# Altium schematic sheet DVD.SchDoc (part 1 of 3)
size A1; SheetNumber: 1; SheetTotal: 1
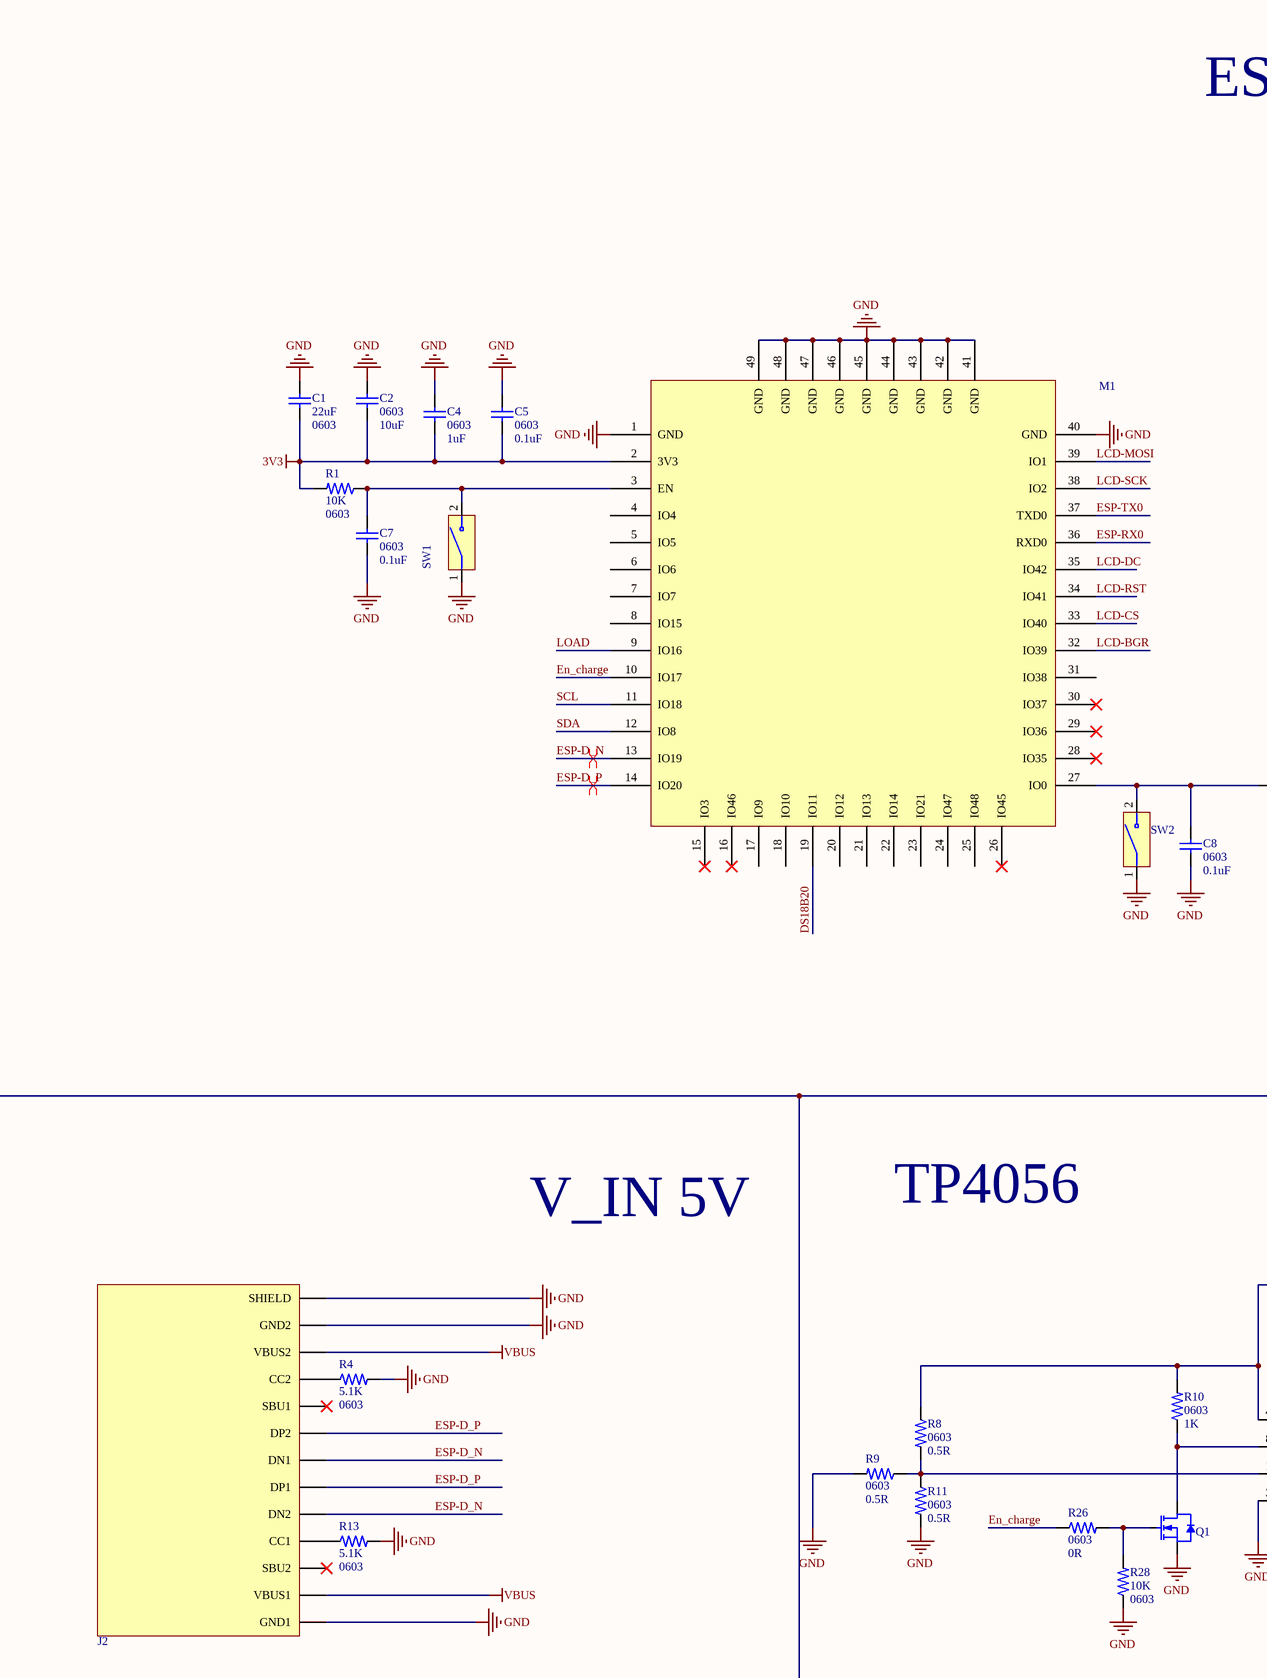
[diagram p0: DVD.SchDoc, top left]
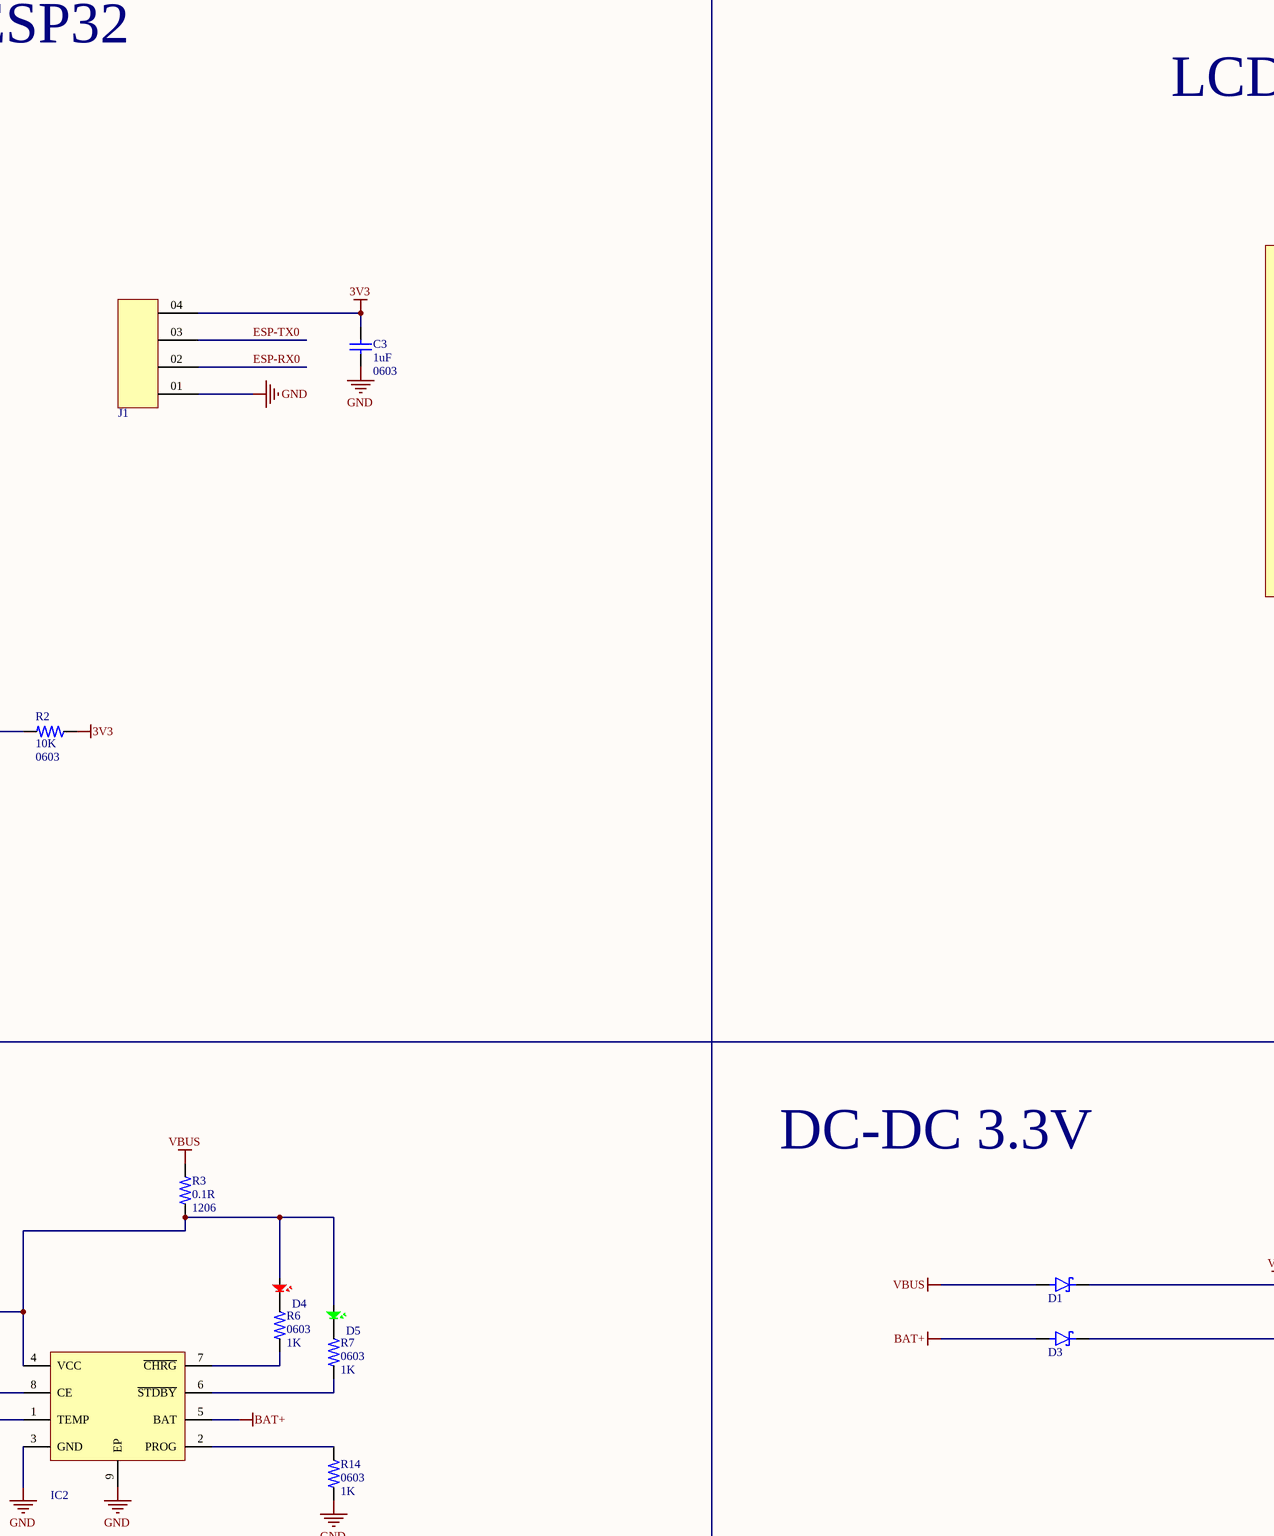
[diagram p1: DVD.SchDoc, top middle]
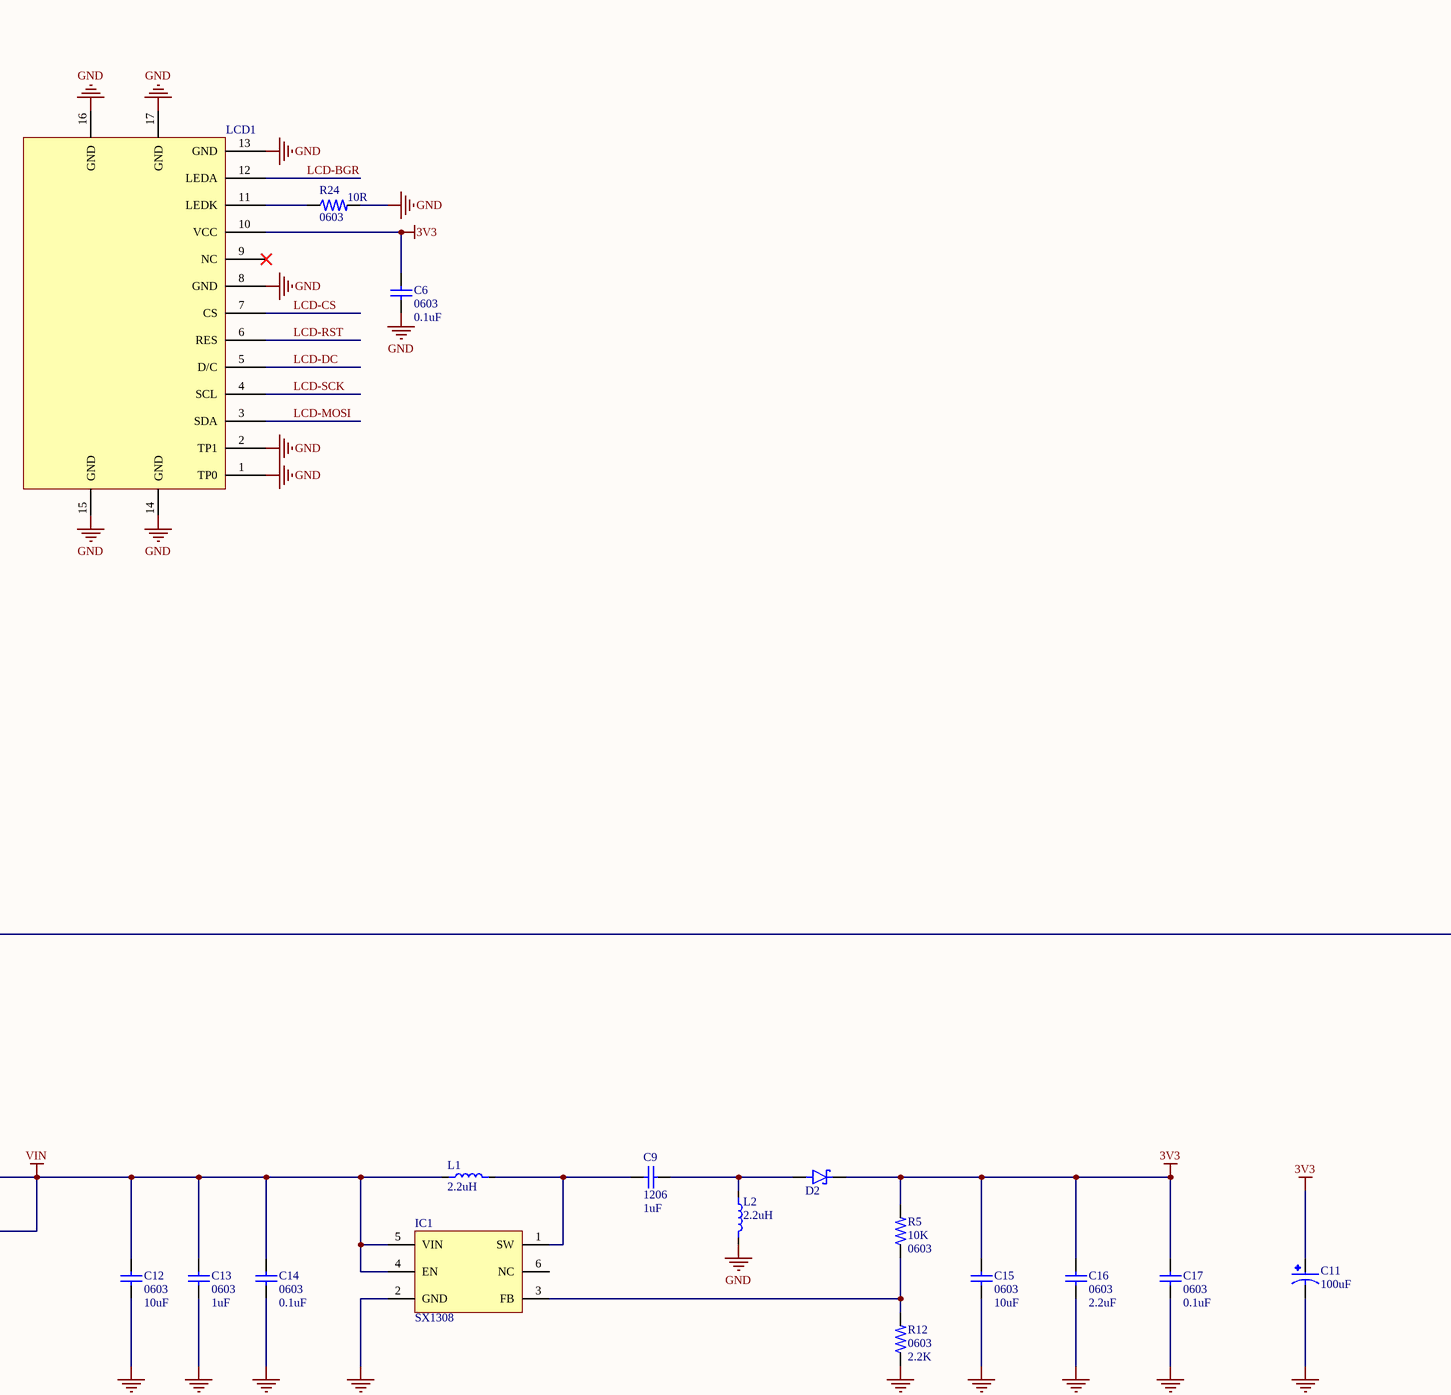
[diagram p2: DVD.SchDoc, top right]
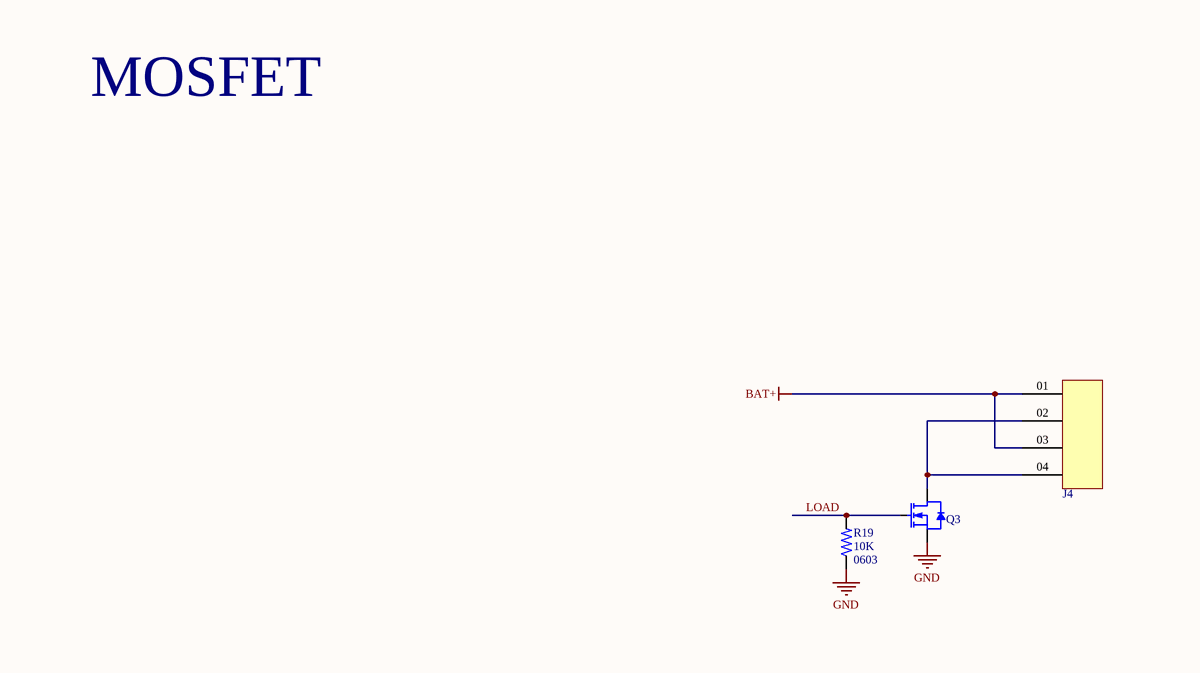
[diagram p3: DVD.SchDoc, bottom left]
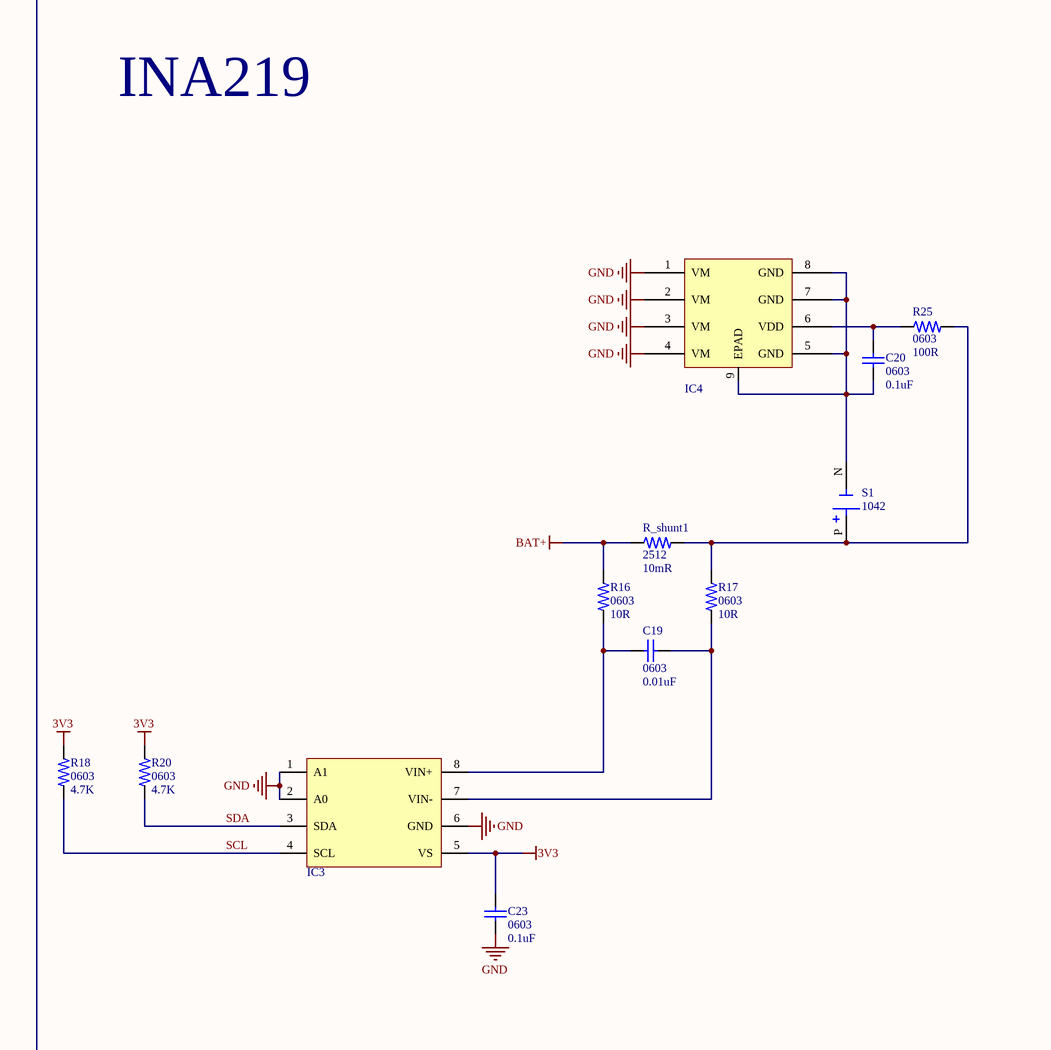
[diagram p4: DVD.SchDoc, bottom middle]
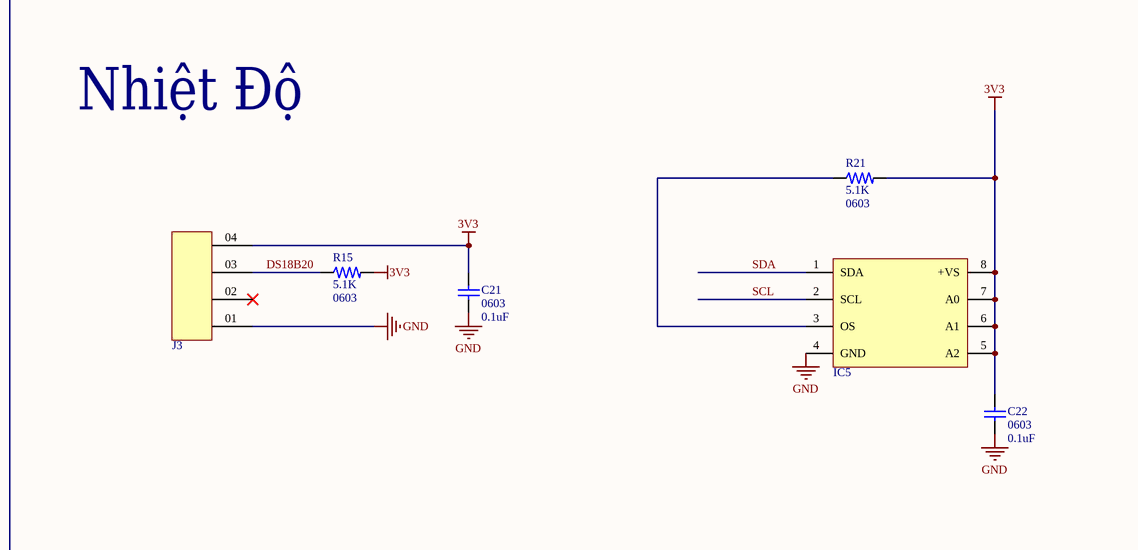
[diagram p5: DVD.SchDoc, bottom right]

## Parts
C1  value 22uF  Package: 0603  [SMD-CAP-0603-YAGEO]  (hidden comment: 22 µF ±20% 10V Ceramic Capacitor X5R 0603 (1608 Metric))
C2  value 10uF  Package: 0603  [SMD-CAP-0603-YAGEO]  (hidden comment: 10 µF ±20% 25V Ceramic Capacitor X5R 0603 (1608 Metric))
C3  value 1uF  Package: 0603  [SMD-CAP-0603-YAGEO]  (hidden comment: 1 µF ±10% 16V Ceramic Capacitor X7R 0603 (1608 Metric))
C4  value 1uF  Package: 0603  [SMD-CAP-0603-YAGEO]  (hidden comment: 1 µF -20%, +80% 10V Ceramic Capacitor Y5V (F) 0603 (1608 Metric))
C5  value 0.1uF  Package: 0603  [SMD-CAP-0603-YAGEO]  (hidden comment: 0.1 µF ±10% 16V Ceramic Capacitor X7R 0603 (1608 Metric))
C6  value 0.1uF  Package: 0603  [SMD-CAP-0603-YAGEO]  (hidden comment: 0.1 µF ±10% 16V Ceramic Capacitor X7R 0603 (1608 Metric))
C7  value 0.1uF  Package: 0603  [SMD-CAP-0603-YAGEO]  (hidden comment: 0.1 µF ±10% 100V Ceramic Capacitor X7R 0603 (1608 Metric))
C8  value 0.1uF  Package: 0603  [SMD-CAP-0603-YAGEO]  (hidden comment: 0.1 µF ±10% 100V Ceramic Capacitor X7R 0603 (1608 Metric))
C9  value 1uF  Package: 1206  [SMD-CAP-1206-KEMET]  (hidden comment: 1 µF ±10% 100V Ceramic Capacitor X7R 1206 (3216 Metric))
C11  value 100uF  [SMD-DxLxW-6.3x6.6x6.6-PEC]  (hidden comment: 100 µF 25 V Aluminum - Polymer Capacitors Radial, Can - SMD 30mOhm 10000 Hrs @ 105°C)
C12  value 10uF  Package: 0603  [SMD-CAP-0603-YAGEO]  (hidden comment: 10 µF ±20% 25V Ceramic Capacitor X5R 0603 (1608 Metric))
C13  value 1uF  Package: 0603  [SMD-CAP-0603-YAGEO]  (hidden comment: 1 µF -20%, +80% 10V Ceramic Capacitor Y5V (F) 0603 (1608 Metric))
C14  value 0.1uF  Package: 0603  [SMD-CAP-0603-YAGEO]  (hidden comment: 0.1 µF ±10% 16V Ceramic Capacitor X7R 0603 (1608 Metric))
C15  value 10uF  Package: 0603  [SMD-CAP-0603-YAGEO]  (hidden comment: 10 µF ±20% 25V Ceramic Capacitor X5R 0603 (1608 Metric))
C16  value 2.2uF  Package: 0603  [SMD-CAP-0603-YAGEO]  (hidden comment: 2.2 µF ±10% 25V Ceramic Capacitor X5R 0603 (1608 Metric))
C17  value 0.1uF  Package: 0603  [SMD-CAP-0603-YAGEO]  (hidden comment: 0.1 µF ±10% 100V Ceramic Capacitor X7R 0603 (1608 Metric))
C19  value 0.01uF  Package: 0603  [SMD-CAP-0603-YAGEO]  (hidden comment: 0.1 µF ±10% 10V Ceramic Capacitor X7R 0603 (1608 Metric))
C20  value 0.1uF  Package: 0603  [SMD-CAP-0603-YAGEO]  (hidden comment: 0.1 µF ±10% 16V Ceramic Capacitor X7R 0603 (1608 Metric))
C21  value 0.1uF  Package: 0603  [SMD-CAP-0603-YAGEO]  (hidden comment: 0.1 µF ±10% 16V Ceramic Capacitor X7R 0603 (1608 Metric))
C22  value 0.1uF  Package: 0603  [SMD-CAP-0603-YAGEO]  (hidden comment: 0.1 µF ±10% 16V Ceramic Capacitor X7R 0603 (1608 Metric))
C23  value 0.1uF  Package: 0603  [SMD-CAP-0603-YAGEO]  (hidden comment: 0.1 µF ±10% 16V Ceramic Capacitor X7R 0603 (1608 Metric))
D1  Diode 40 V 3A Surface Mount DO-214AC (SMA)  [SMD-DO-214AC-214-CT]  (value not drawn)
D2  Diode 40 V 3A Surface Mount DO-214AC (SMA)  [SMD-DO-214AC-214-CT]  (value not drawn)
D3  Diode 40 V 3A Surface Mount DO-214AC (SMA)  [SMD-DO-214AC-214-CT]  (value not drawn)
D4  0603 RED  [LED0603_RED]  (value not drawn)
D5  0603 GREEN  [LED0603_GREEN]  (value not drawn)
IC1  SX1308  [SOT23-6-SX1308]
IC2  TP4056  [SOIC-8-TP4056]  (value not drawn)
IC3  Current Monitor Regulator High-Side 10mA 8-SOIC  [SOIC-8-TI]  (value not drawn)
IC4  XB8089D  [SOIC-8-XB8089D]  (value not drawn)
IC5  Temperature Sensor Digital, Local -55°C ~ 125°C 9 b 8-SOIC  [SOIC-8-ADI]  (value not drawn)
J1  Connector Header Through Hole 4 position 0.100" (2.54mm)  [HEADER-2.54-4 - U3D]  (value not drawn)
J2  USB-C (USB TYPE-C) USB 2.0 Receptacle Connector 24 (16+8 Dummy) Position Surface Mount, Right Angle; Through Hole  [TYPE-C-HOR-RECEPTACLE-24PIN-MOLEX]  (value not drawn)
J3  Connector Header Through Hole 4 position 0.100" (2.54mm)  [HEADER-2.54-4 - U3D]  (value not drawn)
J4  Connector Header Through Hole 4 position 0.100" (2.54mm)  [HEADER-2.54-4 - U3D]  (value not drawn)
L1  value 2.2uH  [SMD-HxLxW-3.0x5.5x5.0-PEC]  (hidden comment: 2.2 µH Shielded Drum Core, Wirewound Inductor 6.3 A 22mOhm Max 2-SMD, J-Lead)
L2  value 2.2uH  [SMD-HxLxW-3.0x5.5x5.0-PEC]  (hidden comment: 2.2 µH Shielded Drum Core, Wirewound Inductor 6.3 A 22mOhm Max 2-SMD, J-Lead)
LCD1  LCD ST7789  [ST7735S-80x160-0.96INCH]  (value not drawn)
M1  Bluetooth, WiFi 802.11b/g/n, Bluetooth v4.2 +EDR Transceiver Module 2.4GHz ~ 2.5GHz PCB Trace Surface Mount  [MODULE-ESP32-S3-WROOM-1-N16R8]  (value not drawn)
Q1  N-Channel 30 V 5.7A (Ta) 1.4W (Ta) Surface Mount SOT-23-3  [SOT23-3-AOEI]  (value not drawn)
Q3  N-Channel 60 V 7A (Ta), 37A (Tc) 2.1W (Ta), 60W (Tc) Surface Mount TO-252 (DPAK)  [TO252]  (value not drawn)
R1  value 10K  Package: 0603  [SMD-RES-0603-YAGEO]  (hidden comment: 10 kOhms ±1% 0.1W, 1/10W Chip Resistor 0603 (1608 Metric) Moisture Resistant Thick Film)
R2  value 10K  Package: 0603  [SMD-RES-0603-YAGEO]  (hidden comment: 10 kOhms ±1% 0.1W, 1/10W Chip Resistor 0603 (1608 Metric) Moisture Resistant Thick Film)
R3  value 0.1R  Package: 1206  [SMD-RES-1206-YAGEO]  (hidden comment: 100 mOhms ±5% 0.25W, 1/4W Chip Resistor 1206 (3216 Metric) Current Sense Thick Film)
R4  value 5.1K  Package: 0603  [SMD-RES-0603-SEI]  (hidden comment: 5.1 kOhms ±1% 0.1W, 1/10W Chip Resistor 0603 (1608 Metric) Automotive AEC-Q200 Thick Film)
R5  value 10K  Package: 0603  [SMD-RES-0603-YAGEO]  (hidden comment: 10 kOhms ±1% 0.1W, 1/10W Chip Resistor 0603 (1608 Metric) Moisture Resistant Thick Film)
R6  value 1K  Package: 0603  [SMD-RES-0603-SEI]  (hidden comment: 1 kOhms ±1% 0.25W, 1/4W Chip Resistor 0603 (1608 Metric) Automotive AEC-Q200, Pulse Withstanding Thick Film)
R7  value 1K  Package: 0603  [SMD-RES-0603-SEI]  (hidden comment: 1 kOhms ±1% 0.25W, 1/4W Chip Resistor 0603 (1608 Metric) Automotive AEC-Q200, Pulse Withstanding Thick Film)
R8  value 0.5R  Package: 0603  [SMD-RES-0603-RS]  (hidden comment: 510 mOhms ±1% 0.2W, 1/5W Chip Resistor 0603 (1608 Metric) Automotive AEC-Q200, Current Sense Thick Film)
R9  value 0.5R  Package: 0603  [SMD-RES-0603-RS]  (hidden comment: 510 mOhms ±1% 0.2W, 1/5W Chip Resistor 0603 (1608 Metric) Automotive AEC-Q200, Current Sense Thick Film)
R10  value 1K  Package: 0603  [SMD-RES-0603-SEI]  (hidden comment: 1 kOhms ±1% 0.25W, 1/4W Chip Resistor 0603 (1608 Metric) Automotive AEC-Q200, Pulse Withstanding Thick Film)
R11  value 0.5R  Package: 0603  [SMD-RES-0603-RS]  (hidden comment: 510 mOhms ±1% 0.2W, 1/5W Chip Resistor 0603 (1608 Metric) Automotive AEC-Q200, Current Sense Thick Film)
R12  value 2.2K  Package: 0603  [SMD-RES-0603-SEI]  (hidden comment: 2.2 kOhms ±1% 0.1W, 1/10W Chip Resistor 0603 (1608 Metric) Automotive AEC-Q200 Thick Film)
R13  value 5.1K  Package: 0603  [SMD-RES-0603-SEI]  (hidden comment: 5.1 kOhms ±1% 0.1W, 1/10W Chip Resistor 0603 (1608 Metric) Automotive AEC-Q200 Thick Film)
R14  value 1K  Package: 0603  [SMD-RES-0603-SEI]  (hidden comment: 1 kOhms ±1% 0.25W, 1/4W Chip Resistor 0603 (1608 Metric) Automotive AEC-Q200, Pulse Withstanding Thick Film)
R15  value 5.1K  Package: 0603  [SMD-RES-0603-SEI]  (hidden comment: 5.1 kOhms ±1% 0.1W, 1/10W Chip Resistor 0603 (1608 Metric) Automotive AEC-Q200 Thick Film)
R16  value 10R  Package: 0603  [SMD-RES-0603-SE]  (hidden comment: 10 Ohms ±1% 0.1W, 1/10W Chip Resistor 0603 (1608 Metric) Automotive AEC-Q200 Thick Film)
R17  value 10R  Package: 0603  [SMD-RES-0603-SE]  (hidden comment: 10 Ohms ±1% 0.1W, 1/10W Chip Resistor 0603 (1608 Metric) Automotive AEC-Q200 Thick Film)
R18  value 4.7K  Package: 0603  [SMD-RES-0603-RS]  (hidden comment: 4.7 kOhms ±1% 0.1W, 1/10W Chip Resistor 0603 (1608 Metric) Anti-Sulfur Thick Film)
R19  value 10K  Package: 0603  [SMD-RES-0603-YAGEO]  (hidden comment: 10 kOhms ±1% 0.1W, 1/10W Chip Resistor 0603 (1608 Metric) Moisture Resistant Thick Film)
R20  value 4.7K  Package: 0603  [SMD-RES-0603-RS]  (hidden comment: 4.7 kOhms ±1% 0.1W, 1/10W Chip Resistor 0603 (1608 Metric) Anti-Sulfur Thick Film)
R21  value 5.1K  Package: 0603  [SMD-RES-0603-SEI]  (hidden comment: 5.1 kOhms ±1% 0.1W, 1/10W Chip Resistor 0603 (1608 Metric) Automotive AEC-Q200 Thick Film)
R24  value 10R  Package: 0603  [SMD-RES-0603-SE]  (hidden comment: 10 Ohms ±1% 0.1W, 1/10W Chip Resistor 0603 (1608 Metric) Automotive AEC-Q200 Thick Film)
R25  value 100R  Package: 0603  [SMD-RES-0603-RS]  (hidden comment: 100 Ohms ±1% 0.1W, 1/10W Chip Resistor 0603 (1608 Metric) Automotive AEC-Q200, High Voltage Thick Film)
R26  value 0R  Package: 0603  [SMD-RES-0603-SEI]  (hidden comment: 0 Ohms Jumper Chip Resistor 0603 (1608 Metric) Automotive AEC-Q200 Thick Film)
R28  value 10K  Package: 0603  [SMD-RES-0603-YAGEO]  (hidden comment: 10 kOhms ±1% 0.1W, 1/10W Chip Resistor 0603 (1608 Metric) Moisture Resistant Thick Film)
R_shunt1  value 10mR  Package: 2512  [SMD-RES-2512-VD]  (hidden comment: 0.1R)
S1  1042  [SMD-18650-BAT-1042]
SW1  Tactile Switch SPST-NO Top Actuated Surface Mount  [SW-HxLxW-5.0x6.0x3.5-C&K]  (value not drawn)
SW2  Tactile Switch SPST-NO Top Actuated Surface Mount  [SW-HxLxW-5.0x6.0x3.5-C&K]  (value not drawn)

## Nets
3V3: C1.2 C2.1 C3.1 C4.2 C5.2 C6.2 C11.1 C15.1 C16.2 C17.2 C21.2 C22.2 C23.2 D2.1(K) IC3.5(VS) IC5.5(A2) IC5.6(A1) IC5.7(A0) IC5.8(+VS) J1.04 J3.04 LCD1.10(VCC) M1.2(3V3) R1.2 R2.1 R5.2 R15.2 R18.1 R20.1 R21.2
BAT+: D3.2(A) IC2.5(BAT) J4.01 J4.03 R16.1 R_shunt1.1
GND: C1.1 C2.2 C3.2 C4.1 C5.1 C6.1 C7.1 C8.1 C11.2 C12.1 C13.1 C14.1 C15.2 C16.1 C17.1 C21.1 C22.1 C23.1 IC1.2(GND) IC2.3(GND) IC2.9(EP) IC3.1(A1) IC3.2(A0) IC3.6(GND) IC4.1(VM) IC4.2(VM) IC4.3(VM) IC4.4(VM) IC5.4(GND) J1.01 J2.A1B12(GND1) J2.B1A12(GND2) J2.SHIELD J3.01 L2.2 LCD1.1(TP0) LCD1.2(TP1) LCD1.8(GND) LCD1.13(GND) LCD1.14(GND) LCD1.15(GND) LCD1.16(GND) LCD1.17(GND) M1.1(GND) M1.40(GND) M1.41(GND) M1.42(GND) M1.43(GND) M1.44(GND) M1.45(GND) M1.46(GND) M1.47(GND) M1.48(GND) M1.49(GND) Q1.2(S) Q3.2(S) R4.2 R9.2 R11.2 R12.1 R13.2 R14.2 R19.1 R24.2 R28.1 SW1.1(COM) SW2.1(COM)
VBUS: D1.2(A) J2.A4B9(VBUS1) J2.B4A9(VBUS2) R3.1
VIN: C12.2 C13.2 C14.2 D1.1(K) D3.1(K) IC1.4(EN) IC1.5(VIN) L1.1
DS18B20: J3.03 M1.19(IO11) R15.1
En_charge: M1.10(IO17) R26.1
ESP-D_N: J2.A7(DN1) J2.B7(DN2) M1.13(IO19)
ESP-D_P: J2.A6(DP1) J2.B6(DP2) M1.14(IO20)
ESP-RX0: J1.02 M1.36(RXD0)
ESP-TX0: J1.03 M1.37(TXD0)
LCD-BGR: LCD1.12(LEDA) M1.32(IO39)
LCD-CS: LCD1.7(CS) M1.33(IO40)
LCD-DC: LCD1.5(D/C) M1.35(IO42)
LCD-MOSI: LCD1.3(SDA) M1.39(IO1)
LCD-RST: LCD1.6(RES) M1.34(IO41)
LCD-SCK: LCD1.4(SCL) M1.38(IO2)
LOAD: M1.9(IO16) Q3.1(G) R19.2
SCL: IC3.4(SCL) IC5.2(SCL) M1.11(IO18) R18.2
SDA: IC3.3(SDA) IC5.1(SDA) M1.12(IO8) R20.2
NetC7_2: C7.2 M1.3(EN) R1.1 SW1.2(NO)
NetC8_2: C8.2 M1.27(IO0) R2.2 SW2.2(NO)
NetC9_1: C9.1 IC1.1(SW) L1.2
NetC9_2: C9.2 D2.2(A) L2.1
NetC19_1: C19.1 IC3.8(VIN+) R16.2
NetC19_2: C19.2 IC3.7(VIN-) R17.2
NetC20_1: C20.1 IC4.5(GND) IC4.7(GND) IC4.8(GND) IC4.9(EPAD) S1.N(NEG)
NetC20_2: C20.2 IC4.6(VDD) R25.1
NetD4_1: D4.1 D5.1 IC2.4(VCC) R3.2 R8.1 R10.2
NetD4_2: D4.2 R6.1
NetD5_2: D5.2 R7.1
NetIC1_3: IC1.3(FB) R5.1 R12.2
NetIC2_1: IC2.1(TEMP) R8.2 R9.1 R11.1
NetIC2_2: IC2.2(PROG) R14.1
NetIC2_6: IC2.6(~{STDBY}) R7.2
NetIC2_7: IC2.7(~{CHRG}) R6.2
NetIC2_8: IC2.8(CE) Q1.3(D) R10.1
NetIC5_3: IC5.3(OS) R21.1
NetJ2_A5: J2.A5(CC1) R13.1
NetJ2_B5: J2.B5(CC2) R4.1
NetJ4_02: J4.02 J4.04 Q3.3(D)
NetLCD1_11: LCD1.11(LEDK) R24.1
NetQ1_1: Q1.1(G) R26.2 R28.2
NetR17_1: R17.1 R25.2 R_shunt1.2 S1.P(POS)

Not connected (* = marked no-connect by the designer): IC1 6(NC); J2 A8(SBU1)* B8(SBU2)*; J3 02(2)*; LCD1 9(NC)*; M1 4(IO4) 5(IO5) 6(IO6) 7(IO7) 8(IO15) 15(IO3)* 16(IO46)* 17(IO9) 18(IO10) 20(IO12) 21(IO13) 22(IO14) 23(IO21) 24(IO47) 25(IO48) 26(IO45)* 28(IO35)* 29(IO36)* 30(IO37)* 31(IO38)

## Layout directives
differential pair: ESP-D_N, ESP-D_P

## Notes on the sheet
- ESP32
- LCD
- V_IN 5V
- TP4056
- DC-DC 3.3V
- MOSFET
- INA219
- Nhiệt Độ